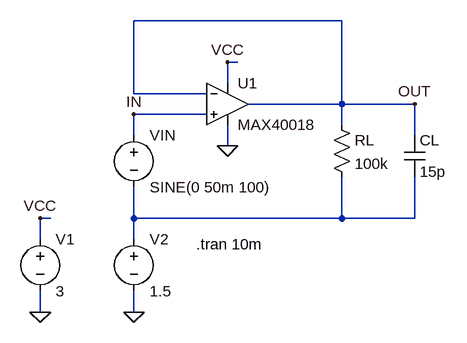
[diagram p0: schematic MAX40018.asc]
MAX40018.asc, the LTspice schematic file:
Version 4
SHEET 1 1720 800
WIRE 624 256 304 256
WIRE 464 320 448 320
WIRE 448 352 448 320
WIRE 304 368 304 256
WIRE 416 368 304 368
WIRE 624 384 624 256
WIRE 624 384 480 384
WIRE 736 384 624 384
WIRE 416 400 304 400
WIRE 624 416 624 384
WIRE 304 432 304 400
WIRE 736 432 736 384
WIRE 448 448 448 416
WIRE 176 560 160 560
WIRE 304 560 304 512
WIRE 624 560 624 496
WIRE 624 560 304 560
WIRE 736 560 736 496
WIRE 736 560 624 560
WIRE 160 592 160 560
WIRE 304 592 304 560
WIRE 160 704 160 672
WIRE 304 704 304 672
FLAG 736 384 OUT
FLAG 160 560 VCC
FLAG 448 320 VCC
FLAG 160 704 0
FLAG 304 400 IN
FLAG 448 448 0
FLAG 304 704 0
SYMBOL voltage 160 576 R0
WINDOW 123 0 0 Left 2
SYMATTR InstName V1
SYMATTR Value 3
SYMBOL res 608 400 R0
SYMATTR InstName RL
SYMATTR Value 100k
SYMBOL voltage 304 416 R0
WINDOW 123 0 0 Left 0
WINDOW 39 0 0 Left 0
SYMATTR InstName VIN
SYMATTR Value SINE(0 50m 100)
SYMBOL cap 720 432 R0
SYMATTR InstName CL
SYMATTR Value 15p
SYMBOL MAX40018 448 320 R0
SYMATTR InstName U1
SYMBOL voltage 304 576 R0
SYMATTR InstName V2
SYMATTR Value 1.5
TEXT 400 600 Left 2 !.tran 10m

The netlist it stands for:
* MAX40018.asc
V1 VCC 0 3
RL OUT N001 100k
VIN IN N001 SINE(0 50m 100)
CL OUT N001 15p
* U1: MAX40018 (symbol MAX40018 not available, pins judged from their places): In+=IN In-=OUT V+=VCC V-=0 OUT=OUT
V2 N001 0 1.5
.tran 10m
.backanno
.end